# Altium schematic sheet 13.SchDoc
size 297 x 209 mm
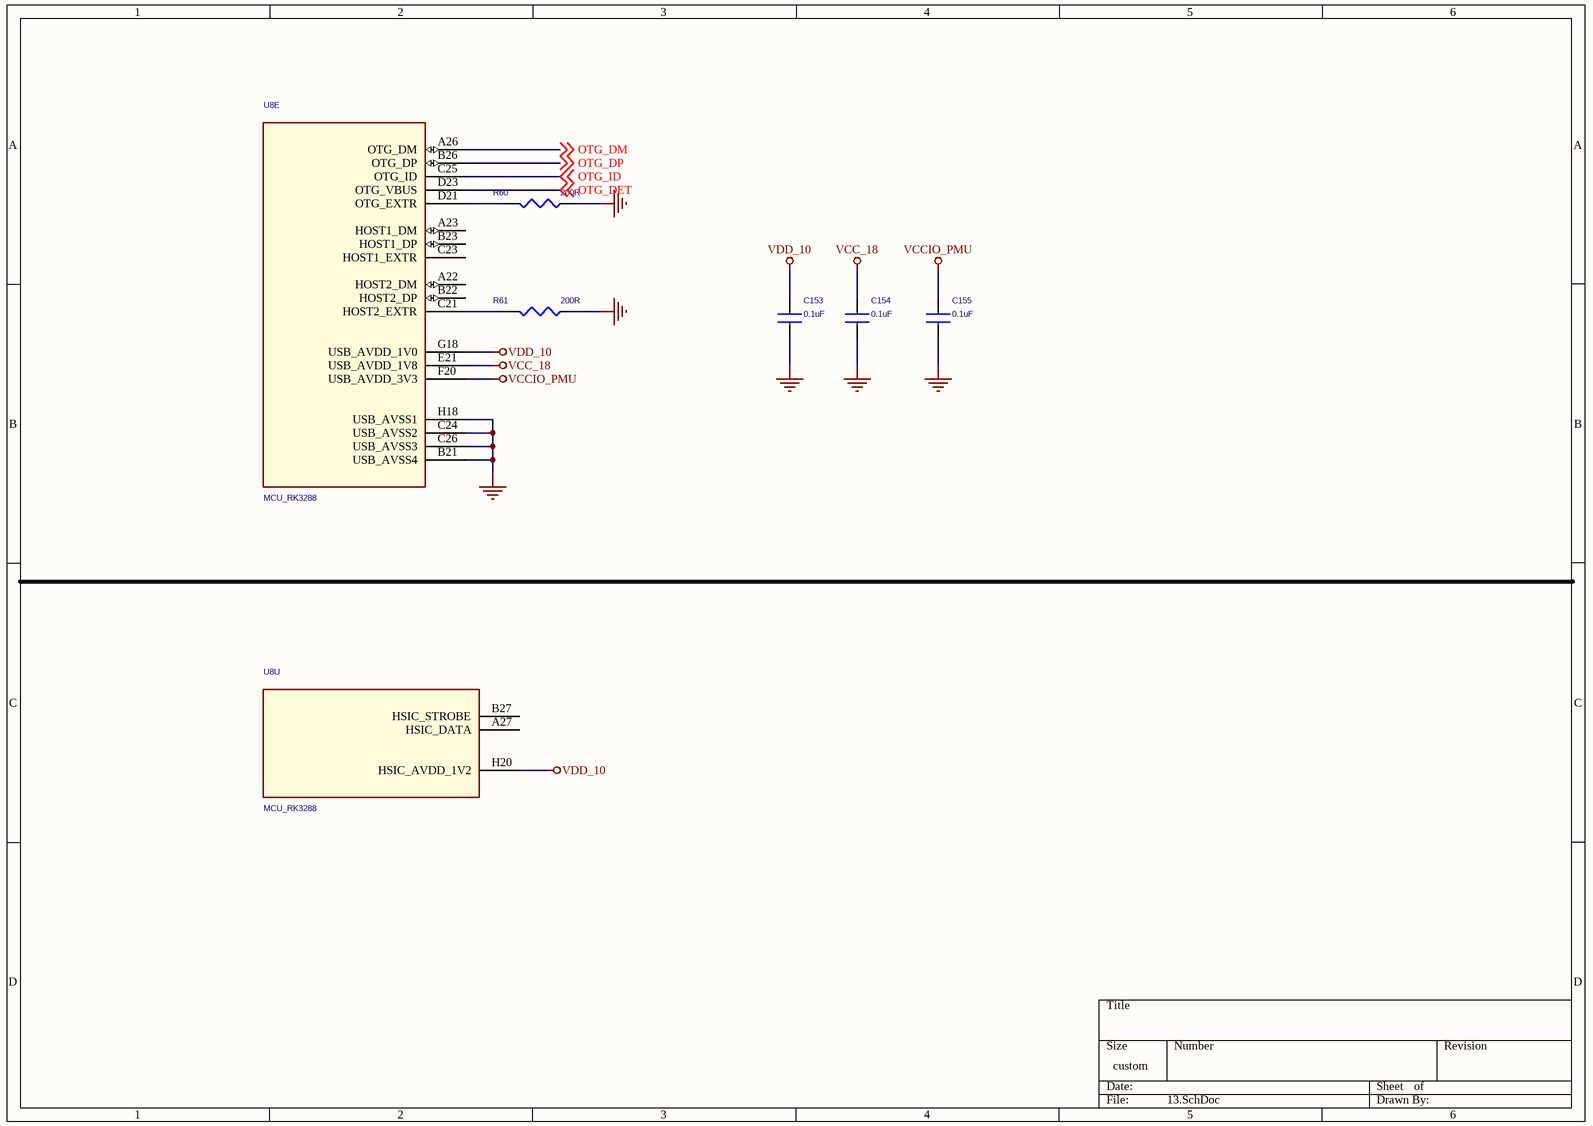
[diagram p0: 13.SchDoc]

## Parts
C153  0.1uF  [C0603]
C154  0.1uF  [C0603]
C155  0.1uF  [C0603]
R60  200R  [r0402]
R61  200R  [r0402]
U8  MCU_RK3288  [BGA453-19X19]  (parts E,U of 24)

## Nets
GND: C153.1 C154.1 C155.1 R60.1 R61.1 U8.B21(USB_AVSS4) U8.C24(USB_AVSS2) U8.C26(USB_AVSS3) U8.H18(USB_AVSS1)
VCC_18: C154.2 U8.E21(USB_AVDD_1V8)
VCCIO_PMU: C155.2 U8.F20(USB_AVDD_3V3)
VDD_10: C153.2 U8.G18(USB_AVDD_1V0) U8.H20(HSIC_AVDD_1V2)
OTG_DET: U8.D23(OTG_VBUS) ; off-sheet OTG_DET
OTG_DM: U8.A26(OTG_DM) ; off-sheet OTG_DM
OTG_DP: U8.B26(OTG_DP) ; off-sheet OTG_DP
OTG_ID: U8.C25(OTG_ID) ; off-sheet OTG_ID
NetR60_2: R60.2 U8.D21(OTG_EXTR)
NetR61_2: R61.2 U8.C21(HOST2_EXTR)

Not connected (* = marked no-connect by the designer): U8 A22(HOST2_DM) A23(HOST1_DM) A27(HSIC_DATA) B22(HOST2_DP) B23(HOST1_DP) B27(HSIC_STROBE) C23(HOST1_EXTR)

## Library data of the parts
C153 C154 = CAP NP_Dup3: 贴片电容; MARK: 106; ROOM: USB+5V
C155 = CAP NP_Dup3: 贴片电容; ROOM: USB+5V; MARK: 106
R60 R61 = RESISTOR_1_Dup2
U8 = MCU_RK3288_3